# EAGLE design relay_board (EAGLE 7.7.0)
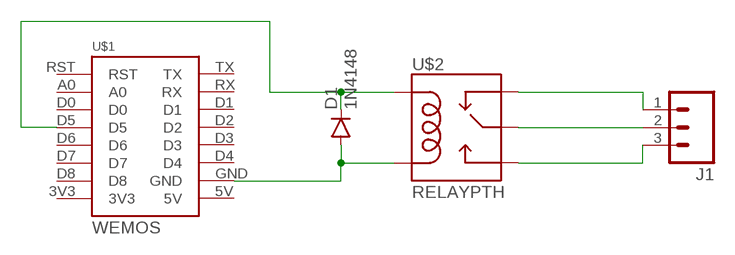
[diagram p0: schematic, sheet 1]

## Parts
D1  1N4148  DIODE1N4148  [DIODE-1N4148]
J1  M03SCREW  [SCREWTERMINAL-3.5MM-3]
U$1  WEMOS  [WEMOS]
U$2  RELAYPTH  [RELAY-G5Q]

## Nets
N$1: D1.A U$1.GND U$2.1(COIL2)
N$2: D1.C U$1.D5 U$2.5(COIL1)
N$3: J1.1 U$2.4(NC)
N$4: J1.2 U$2.2(MAIN)
N$5: J1.3 U$2.3(NO)
Unconnected: U$1.3V3 U$1.5V U$1.A0 U$1.D0 U$1.D1 U$1.D2 U$1.D3 U$1.D4 U$1.D6 U$1.D7 U$1.D8 U$1.RST U$1.RX U$1.TX

## Library data of the parts
D1 = SparkFun-DiscreteSemi:DIODE: Diode These are standard reverse protection diodes and small signal diodes. SMA package can handle up to about 1A. SOD-323 can handle about 200mA. What the SOD-323 package when ordering, there are some mfgs out there that are 5-pin packages.; PROD_ID: DIO-08378
J1 = SparkFun-Connectors:M03: Header 3 Standard 3-pin 0.1" header. Use with straight break away headers (SKU : PRT-00116), right angle break away headers (PRT-00553), swiss pins (PRT-00743), machine pins (PRT-00117), and female headers (PRT-00115). Molex polarized connector foot print use with SKU : PRT-08232 with associated crimp pins and housings.; PROD_ID: CONN-08288
U$1 = 1455413453956-wemos:WEMOS
U$2 = SparkFun-Electromechanical:RELAY: SPDT relay (COM-00101)

## Board
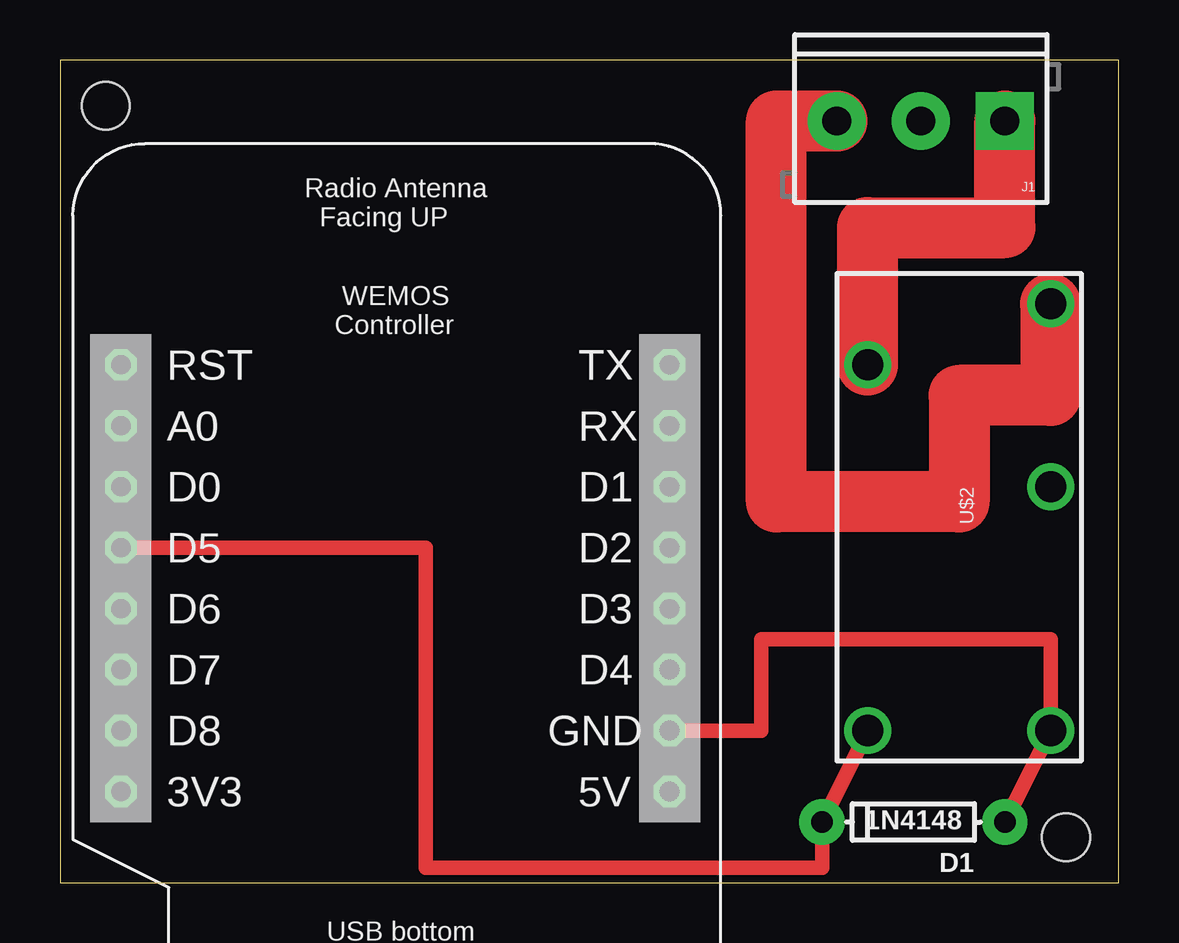
[diagram p1: board, top side]
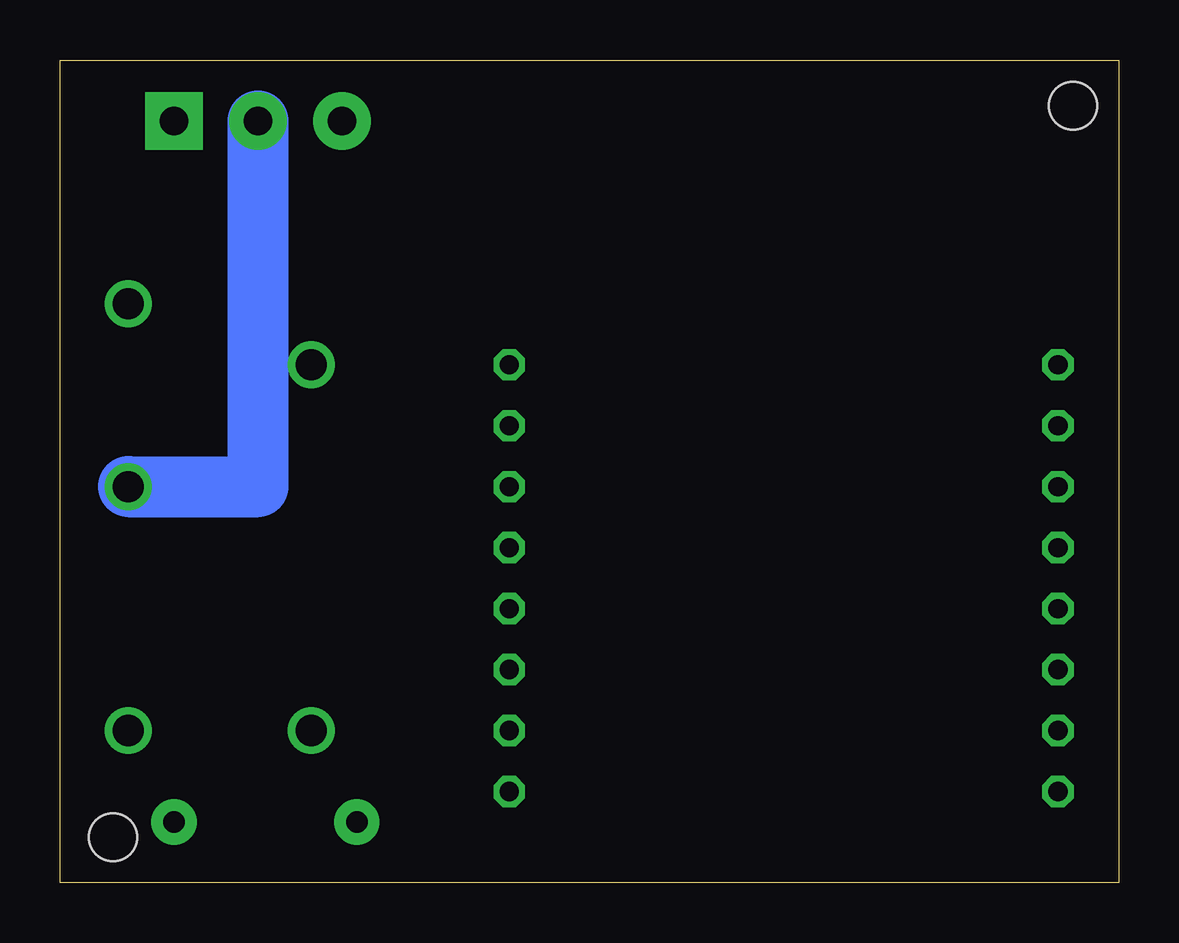
[diagram p2: board, bottom side, seen from below]

Size 44.12 x 34.28 mm. Coordinates in mm from the lower left corner, seen from the top.
Outline: 0,0 44.12,0 44.12,34.28 0,34.28 0,0
Copper layers (1*16): Top 0.035mm / dielectric 1.5mm / Bottom 0.035mm
Design rules "default": minimum track width 10mil, minimum drill 24mil, track to track 8mil, track to pad 8mil, pad to pad 8mil, via to via 8mil, smd to smd 8mil, copper to edge 40mil, drill to drill 8mil, minimum pad ring 10mil, minimum via ring 8mil, stop-mask expansion 4mil, vias tented up to drill 0mil, thermal gap 10mil
Holes 2 mm at 1.91,32.38 41.91,1.91

### Footprints (pad centres in the part's own frame; a part is rotated, then mirrored left to right if it is on the bottom)
DIODE-1N4148 = drill 0.9 pad 1.88: A -3.81,0; C 3.81,0
SCREWTERMINAL-3.5MM-3 = drill 1.2 pad 2.413 square: 1 0,0 | drill 1.2 pad 2.413: 2 3.5,0; 3 7,0
WEMOS = drill 0.8 octagon: 3V3 0,0; 5V 22.86,0; A0 0,15.24; D0 0,12.7; D1 22.86,12.7; D2 22.86,10.16; D3 22.86,7.62; D4 22.86,5.08; D5 0,10.16; D6 0,7.62; D7 0,5.08; D8 0,2.54; GND 22.86,2.54; RST 0,17.78; RX 22.86,15.24; TX 22.86,17.78
RELAY-G5Q = drill 1.3: 1 8.89,3.81; 2 -1.27,3.81; 3 -8.89,3.81; 4 -6.35,-3.81; 5 8.89,-3.81

### Placement (x,y rotation side)
D1  35.56,2.54 180 top
J1  39.37,31.75 180 top
U$1  2.54,3.81 0 top
U$2  37.47,15.24 270 top

### Tracks (layer width: path | path; a pad name or v marks a point on that pad's centre or on a via)
N$1
  Top 0.61: U$1.GND 29.21,6.35 29.21,10.16 41.27,10.16 U$2.1 D1.A
N$2
  Top 0.61: U$1.D5 15.24,13.97 15.24,0.64 31.75,0.64 D1.C U$2.5
N$3
  Top 2.54: U$2.4 33.66,27.3 39.37,27.3 J1.1
N$4
  Bottom 2.54: U$2.2 35.87,16.51 J1.2
N$5
  Top 2.54: U$2.3 41.27,20.32 37.47,20.32 37.47,15.88 29.84,15.88 29.84,31.75 J1.3